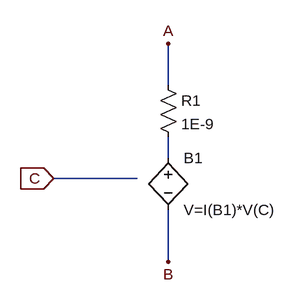
[diagram p0: schematic Variable_Resistor.asc]
Variable_Resistor.asc, the LTspice schematic file:
Version 4
SHEET 1 880 680
WIRE -96 80 -96 16
WIRE -96 192 -96 160
WIRE -144 224 -272 224
WIRE -96 352 -96 272
FLAG -272 224 C
IOPIN -272 224 In
FLAG -96 16 A
FLAG -96 352 B
SYMBOL res -112 64 R0
SYMATTR InstName R1
SYMATTR Value 1E-9
SYMBOL bv -96 176 R0
SYMATTR InstName B1
SYMATTR Value V=I(B1)*V(C)

The netlist it stands for:
* Variable_Resistor.asc
R1 A N001 1E-9
B1 N001 B V=I(B1)*V(C)
.backanno
.end